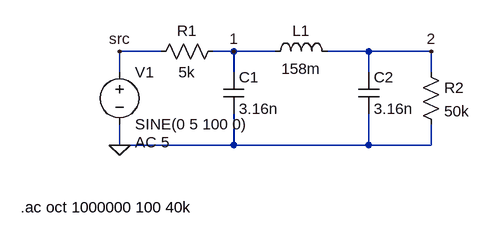
[diagram p0: schematic 4.2.asc]
4.2.asc, the LTspice schematic file:
Version 4
SHEET 1 880 680
WIRE -128 64 -192 64
WIRE -16 64 -48 64
WIRE 48 64 -16 64
WIRE 192 64 128 64
WIRE 288 64 192 64
WIRE -192 96 -192 64
WIRE -16 96 -16 64
WIRE 192 96 192 64
WIRE 288 96 288 64
WIRE -192 208 -192 176
WIRE -16 208 -16 160
WIRE -16 208 -192 208
WIRE 192 208 192 160
WIRE 192 208 -16 208
WIRE 288 208 288 176
WIRE 288 208 192 208
FLAG -192 208 0
FLAG -192 64 src
FLAG 288 64 2
FLAG -16 64 1
SYMBOL voltage -192 80 R0
WINDOW 123 24 124 Left 2
WINDOW 39 0 0 Left 0
SYMATTR Value2 AC 5
SYMATTR InstName V1
SYMATTR Value SINE(0 5 100 0)
SYMBOL res -144 80 R270
WINDOW 0 32 56 VTop 2
WINDOW 3 0 56 VBottom 2
SYMATTR InstName R1
SYMATTR Value 5k
SYMBOL ind 32 80 R270
WINDOW 0 32 56 VTop 2
WINDOW 3 5 56 VBottom 2
SYMATTR InstName L1
SYMATTR Value 158m
SYMBOL cap -32 96 R0
SYMATTR InstName C1
SYMATTR Value 3.16n
SYMBOL res 272 80 R0
SYMATTR InstName R2
SYMATTR Value 50k
SYMBOL cap 176 96 R0
SYMATTR InstName C2
SYMATTR Value 3.16n
TEXT -344 304 Left 2 !.ac oct 1000000 100 40k

The netlist it stands for:
* 4.2.asc
V1 src 0 SINE(0 5 100 0) AC 5
R1 src 1 5k
L1 1 2 158m
C1 1 0 3.16n
R2 2 0 50k
C2 2 0 3.16n
.ac oct 1000000 100 40k
.backanno
.end